# Altium schematic sheet EFR32xG27_BLE_AGR_REF_DES_A00_Sheet1.SchDoc
size 420 x 297 mm
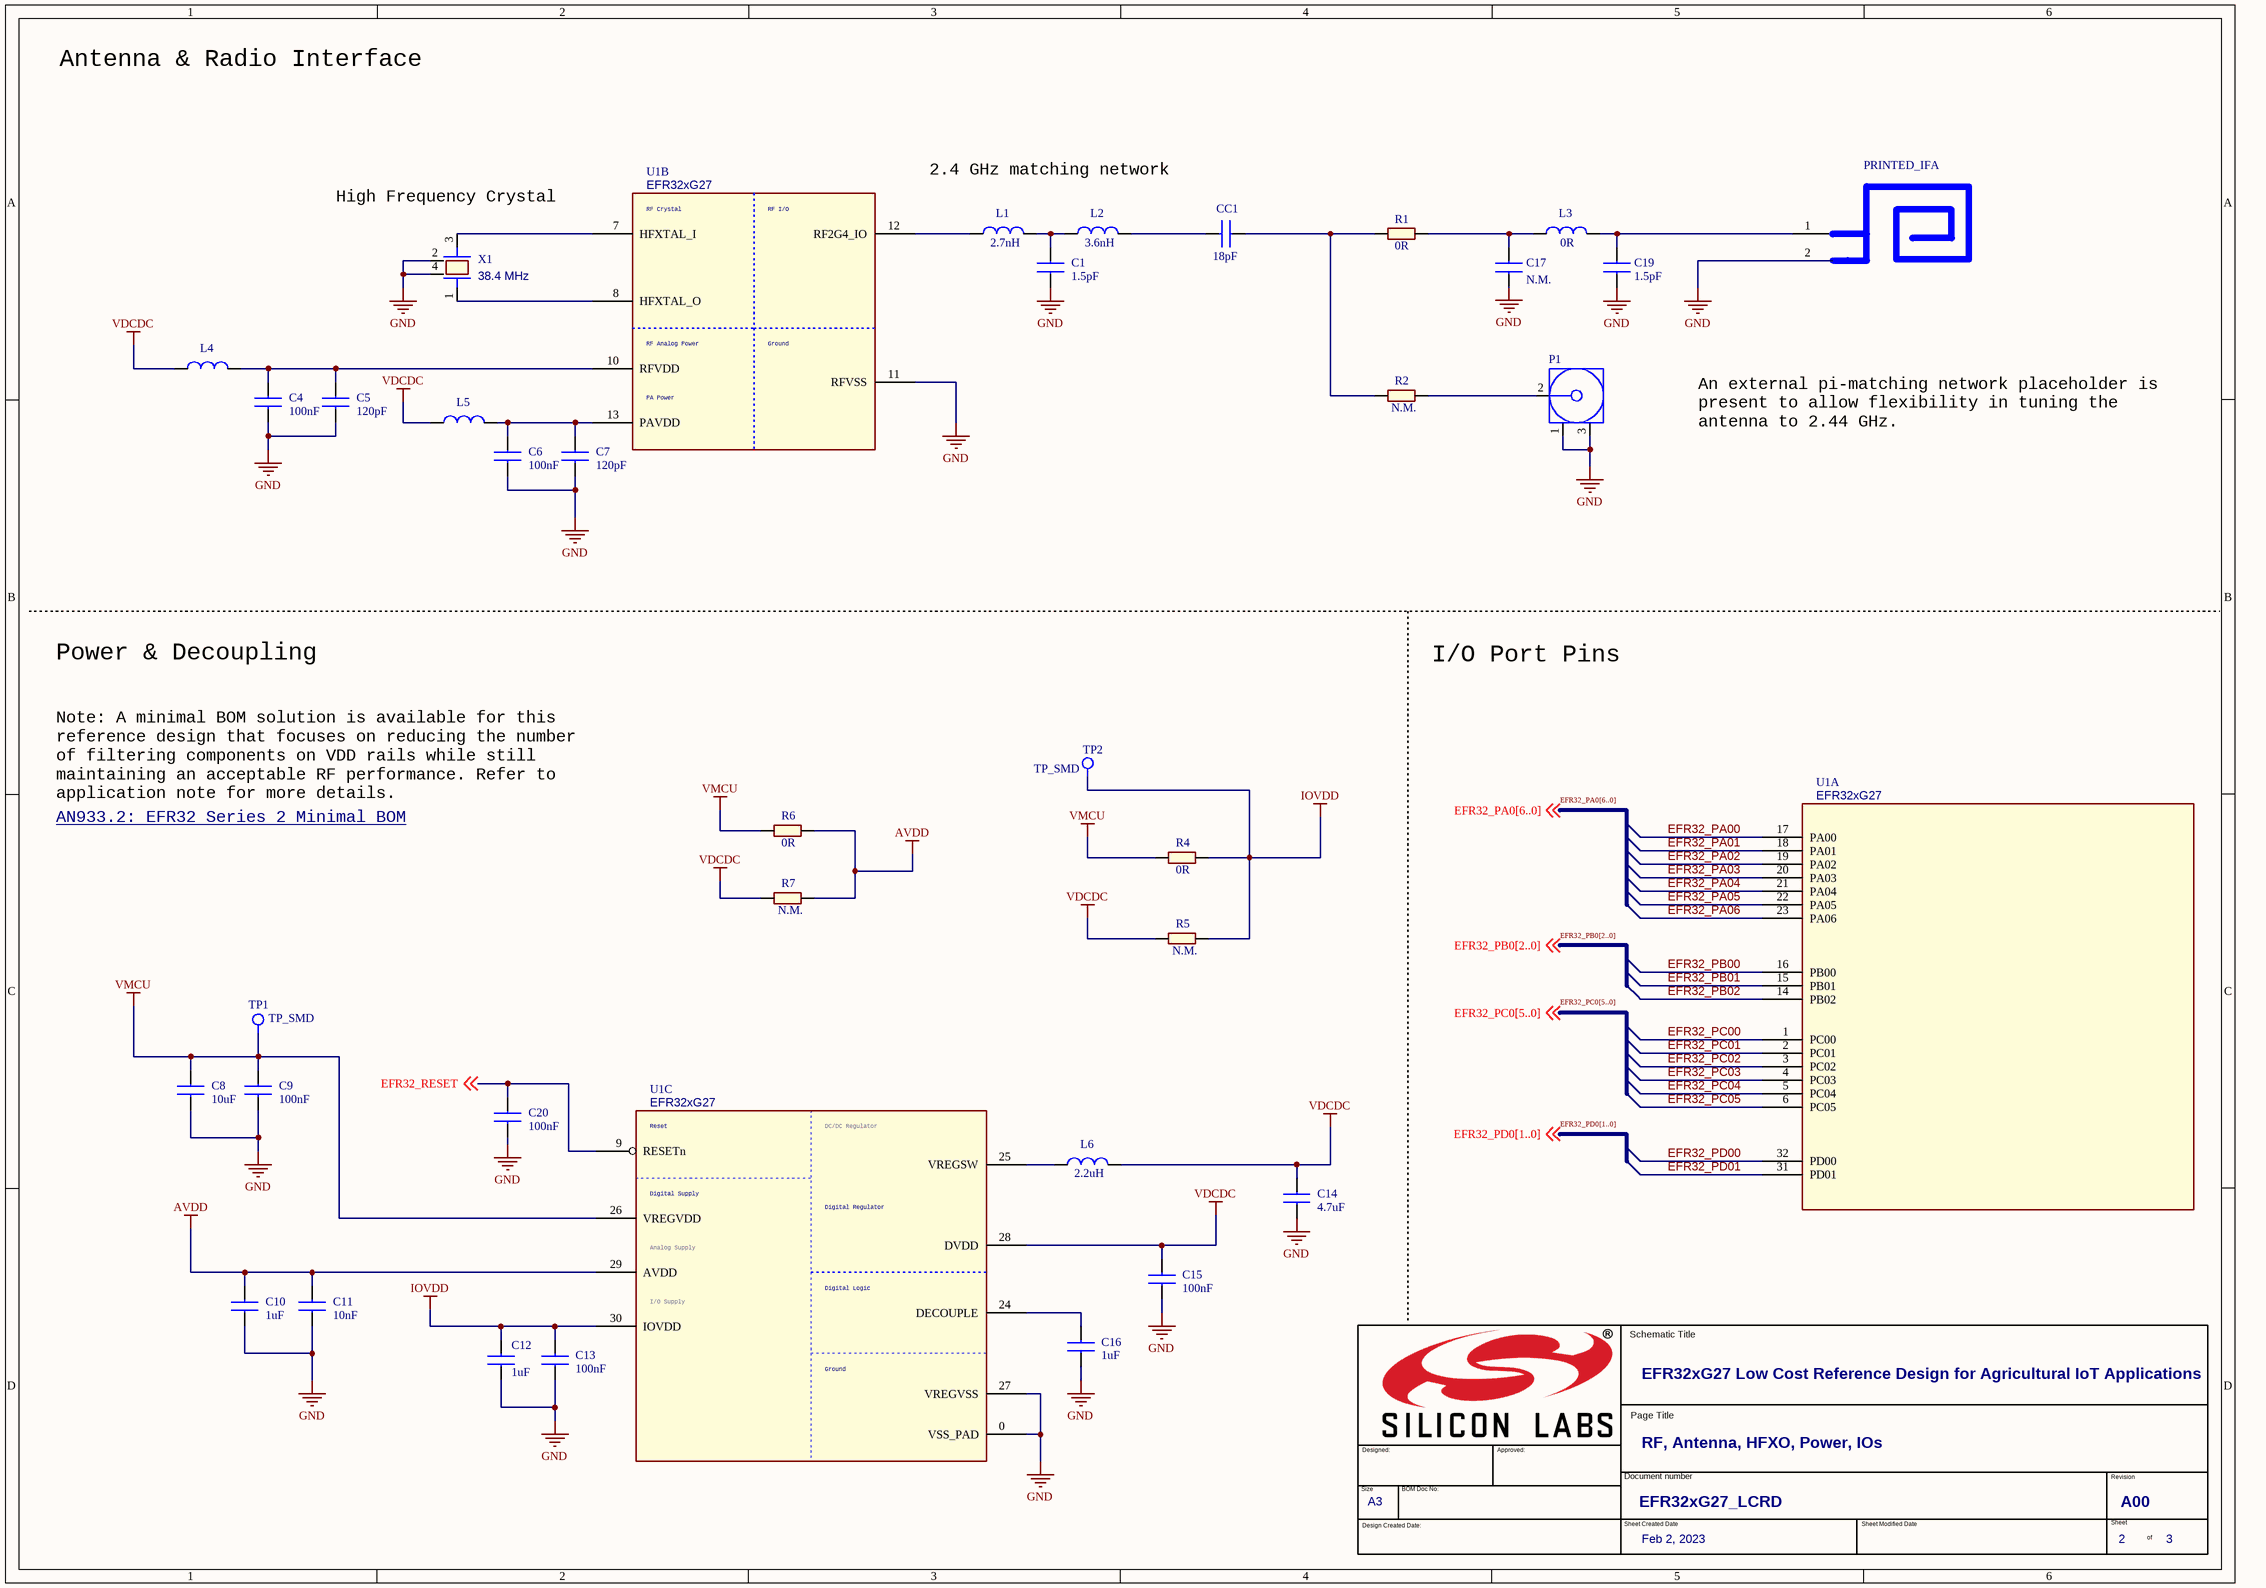
[diagram p0: EFR32xG27_BLE_AGR_REF_DES_A00_Sheet1.SchDoc]

## Parts
*?  Page Title: RF, Antenna, HFXO, Power, IOs  Page Size: A3  Title: EFR32xG27 Low Cost Reference Design for Agricultural IoT Applications  Page Number: 2  Page Count: 3  (hidden comment: TitleBlock_EnergyMicro_A3)  (graphical)
AT1  PRINTED_IFA  [SPIRAL_IFA_INV]
C1  value 1.5pF  [0201]
C4  value 100nF  [0201]
C5  value 120pF  [0201]
C6  value 100nF  [0201]
C7  value 120pF  [0201]
C8  value 10uF  [C_0402]
C9  value 100nF  [0201]
C10  value 1uF  [C_0402]
C11  value 10nF  [0201]
C12  value 1uF  [C_0402]
C13  value 100nF  [0201]
C14  value 4.7uF  [C_0402]
C15  value 100nF  [0201]
C16  value 1uF  [C_0402]
C17  Not Mounted: N.M.  [0201]
C19  value 1.5pF  [0201]
C20  value 100nF  [0201]
CC1  value 18pF  [0201]
L1  value 2.7nH  [0201]
L2  value 3.6nH  [0201]
L3  value 0R  [0201]
L4  (no value)  [L_0603]
L5  (no value)  [L_0603]
L6  value 2.2uH  [L_0603]
P1  1909763-1  [TECO-1909763-1_V]  (value not drawn)
R1  value 0R  [0201]
R2  Not Mounted: N.M.  [0201]
R4  value 0R  [0201]
R5  Not Mounted: N.M.  [0201]
R6  value 0R  [0201]
R7  Not Mounted: N.M.  [0201]
TP1  TP_SMD  [TP]
TP2  TP_SMD  [TP]
U1  EFR32xG27  [EFR_QFN32]  (parts A,B,C of 3)
X1  38.4 MHz  [HFXO_TZ2205E]

## Nets
AVDD: C10.1 C11.1 R6.2 R7.2 U1.29(AVDD)
GND: AT1.2(GND) C1.2 C4.2 C5.2 C6.2 C7.2 C8.2 C9.2 C10.2 C11.2 C12.2 C13.2 C14.2 C15.2 C16.2 C17.2 C19.2 C20.2 P1.1 P1.3 U1.0(VSS_PAD) U1.11(RFVSS) U1.27(VREGVSS) X1.2 X1.4
IOVDD: C12.1 C13.1 R4.2 R5.2 TP2.1(TP) U1.30(IOVDD)
VDCDC: C14.1 C15.1 L4.1 L5.1 L6.2 R5.1 R7.1 U1.28(DVDD)
VMCU: C8.1 C9.1 R4.1 R6.1 TP1.1(TP) U1.26(VREGVDD)
EFR32_PA00: U1.17(PA00)
EFR32_PA01: U1.18(PA01)
EFR32_PA02: U1.19(PA02)
EFR32_PA03: U1.20(PA03)
EFR32_PA04: U1.21(PA04)
EFR32_PA05: U1.22(PA05)
EFR32_PA06: U1.23(PA06)
EFR32_PB00: U1.16(PB00)
EFR32_PB01: U1.15(PB01)
EFR32_PB02: U1.14(PB02)
EFR32_PC00: U1.1(PC00)
EFR32_PC01: U1.2(PC01)
EFR32_PC02: U1.3(PC02)
EFR32_PC03: U1.4(PC03)
EFR32_PC04: U1.5(PC04)
EFR32_PC05: U1.6(PC05)
EFR32_PD00: U1.32(PD00)
EFR32_PD01: U1.31(PD01)
EFR32_RESET: C20.1 U1.9(RESETn) ; off-sheet EFR32_RESET
NetC1_1: C1.1 L1.2 L2.1
NetC4_1: C4.1 C5.1 L4.2 U1.10(RFVDD)
NetC6_1: C6.1 C7.1 L5.2 U1.13(PAVDD)
NetC16_1: C16.1 U1.24(DECOUPLE)
NetC17_1: C17.1 L3.1 R1.2
NetC19_1: C19.1 L3.2
NetCC1_1: CC1.1 L2.2
NetCC1_2: CC1.2 R1.1 R2.1
NetL1_1: L1.1 U1.12(RF2G4_IO)
NetL6_1: L6.1 U1.25(VREGSW)
NetP1_2: P1.2 R2.2
NetU1_7: U1.7(HFXTAL_I) X1.3
NetU1_8: U1.8(HFXTAL_O) X1.1

Not connected (* = marked no-connect by the designer): AT1 1(RF)

## Buses and harness runs
bus EFR32_PA0[6..0]
bus EFR32_PB0[2..0]
bus EFR32_PC0[5..0]
bus EFR32_PD0[1..0]

## Notes on the sheet
- Antenna & Radio Interface
- 2.4 GHz matching network
- (near X1) High Frequency Crystal
- An external pi-matching network placeholder is present to allow flexibility in tuning the antenna to 2.44 GHz.
- Power & Decoupling
- I/O Port Pins
- Note: A minimal BOM solution is available for this reference design that focuses on reducing the number of filtering components on VDD rails while still maintaining an acceptable RF performance. Refer to application note for more details.
- AN933.2: EFR32 Series 2 Minimal BOM
- Feb 2, 2023
- EFR32xG27_LCRD
- A00
- Labels drawn without touching a wire or pin: EFR32_PA0[6..0], EFR32_PB0[2..0], EFR32_PC0[5..0], EFR32_PD0[1..0]
- (in symbol EFR32xG22-2.4GHZ-QFN32, part B) RF Crystal; RF I/O; RF Analog Power; Ground; PA Power
- (in symbol EFR32xG22-2.4GHZ-QFN32, part C) Reset; DC/DC Regulator; Digital Supply; Digital Regulator; Analog Supply; Digital Logic; I/O Supply; Ground
- (in symbol TitleBlock_EnergyMicro_A3) Schematic Title; Page Title; Designed:; Approved:; Document number; Revision; Size; BOM Doc No:; Design Created Date:; Sheet Created Date; Sheet Modified Date; Sheet; of

## Library data of the parts
*? = TitleBlock_EnergyMicro_A3: OrgName: Silicon Labs
AT1 = SPIRAL_IFA
C1 C19 = C0201: Ceramic capacitor; Manufacturer: Murata; Part Number: GRM0335C1H1R5BA01; Rating: 50V; Tolerance: 0.1pF; Technology: C0G; Package: SMD0201
C4 C6 C9 C13 C15 C20 = C0201: Ceramic capacitor; Manufacturer: Murata; Part Number: GRM033R61E104ME14; Rating: 25V; Tolerance: 20%; Technology: X5R; Package: SMD0201
C5 C7 = C0201: Ceramic capacitor; Manufacturer: Murata; Part Number: GRM0335C1H121JA01; Rating: 50V; Tolerance: 5%; Technology: C0G; Package: SMD0201
C8 = C0201: Ceramic capacitor; Manufacturer: Murata; Part Number: GRM155R61C105MA12; Rating: 6.3V; Tolerance: 20%; Technology: X5R; Package: SMD0402
C10 C12 C16 = C0201: Ceramic capacitor; Manufacturer: Murata; Part Number: GRM155R61C105MA12; Rating: 16V; Tolerance: 20%; Technology: X5R; Package: SMD0402
C11 = C0201: Ceramic capacitor; Manufacturer: Murata; Part Number: GRM033R61A103MA01; Rating: 10V; Tolerance: 20%; Technology: X5R; Package: SMD0201
C14 = C0201: Ceramic capacitor; Manufacturer: Murata; Part Number: GRM155R61C105MA12; Rating: 10V; Tolerance: 20%; Technology: X6T; Package: SMD0402
C17 = C0201: Ceramic capacitor; Manufacturer: Murata; Part Number: GRM0335C1H1R6BA01; Rating: 50V; Tolerance: 0.1pF; Technology: C0G; Package: SMD0201
CC1 = C0201: Ceramic capacitor; Manufacturer: Murata; Part Number: GRM0335C1H180JA01; Rating: 50V; Tolerance: 5%; Technology: C0G; Package: SMD0201
L1 = L0201: Chip Inductor; Part Number: LQP03TN2N7B02; Manufacturer: Murata; Tolerance: 0.1nH; Rating: 500mA; Package: SMD0201
L2 = L0201: Chip Inductor; Part Number: LQP03TN3N6B02; Manufacturer: Murata; Tolerance: 0.1nH; Rating: 400mA; Package: SMD0201
L3 = L0201: Chip Inductor; Part Number: LQP03TN5N1H02; Manufacturer: Murata; Tolerance: 3%; Rating: 350mA; Package: SMD0201
L4 L5 = L0201: Ferrite Bead; Part Number: BLM18AG102SN1; Manufacturer: Murata; Value: 1000R; Rating: 450mA; DCR: 0.5R; Package: SMD0603
L6 = L0201: Ferrite Bead; Part Number: LQM18PZ2R2MFH; Manufacturer: Murata; Tolerance: 20%; Rating: 300mA; Package: SMD0603
P1 = CN-1P-M-RF3: SMT Ultra Miniature Coaxial Connector 50-ohm Jack, Female; Manufacturer: TE Connectivity; Package: TECO-1909763-1, 2.6 x 2.6 mm
R1 R4 R6 = R0201: zero ohm resistor; Manufacturer: Any
R2 R5 R7 = R0201: zero ohm resistor; Manufacturer: Any; Value: 0R
U1 = EFR32xG22-2.4GHZ-QFN32: 32-pin Wireless MCU, EFR32xG27 with buck converter; Manufacturer: Silicon Labs; Package: QFN32
X1 = HFXO: 38.4 MHz high frequency crystal; Part Number: TZ3398B; Manufacturer: Tai-Saw Technology; Tolerance: 20ppm; Load capacitance: 10pF